# EAGLE board v.0.0.0 (EAGLE 5.11)
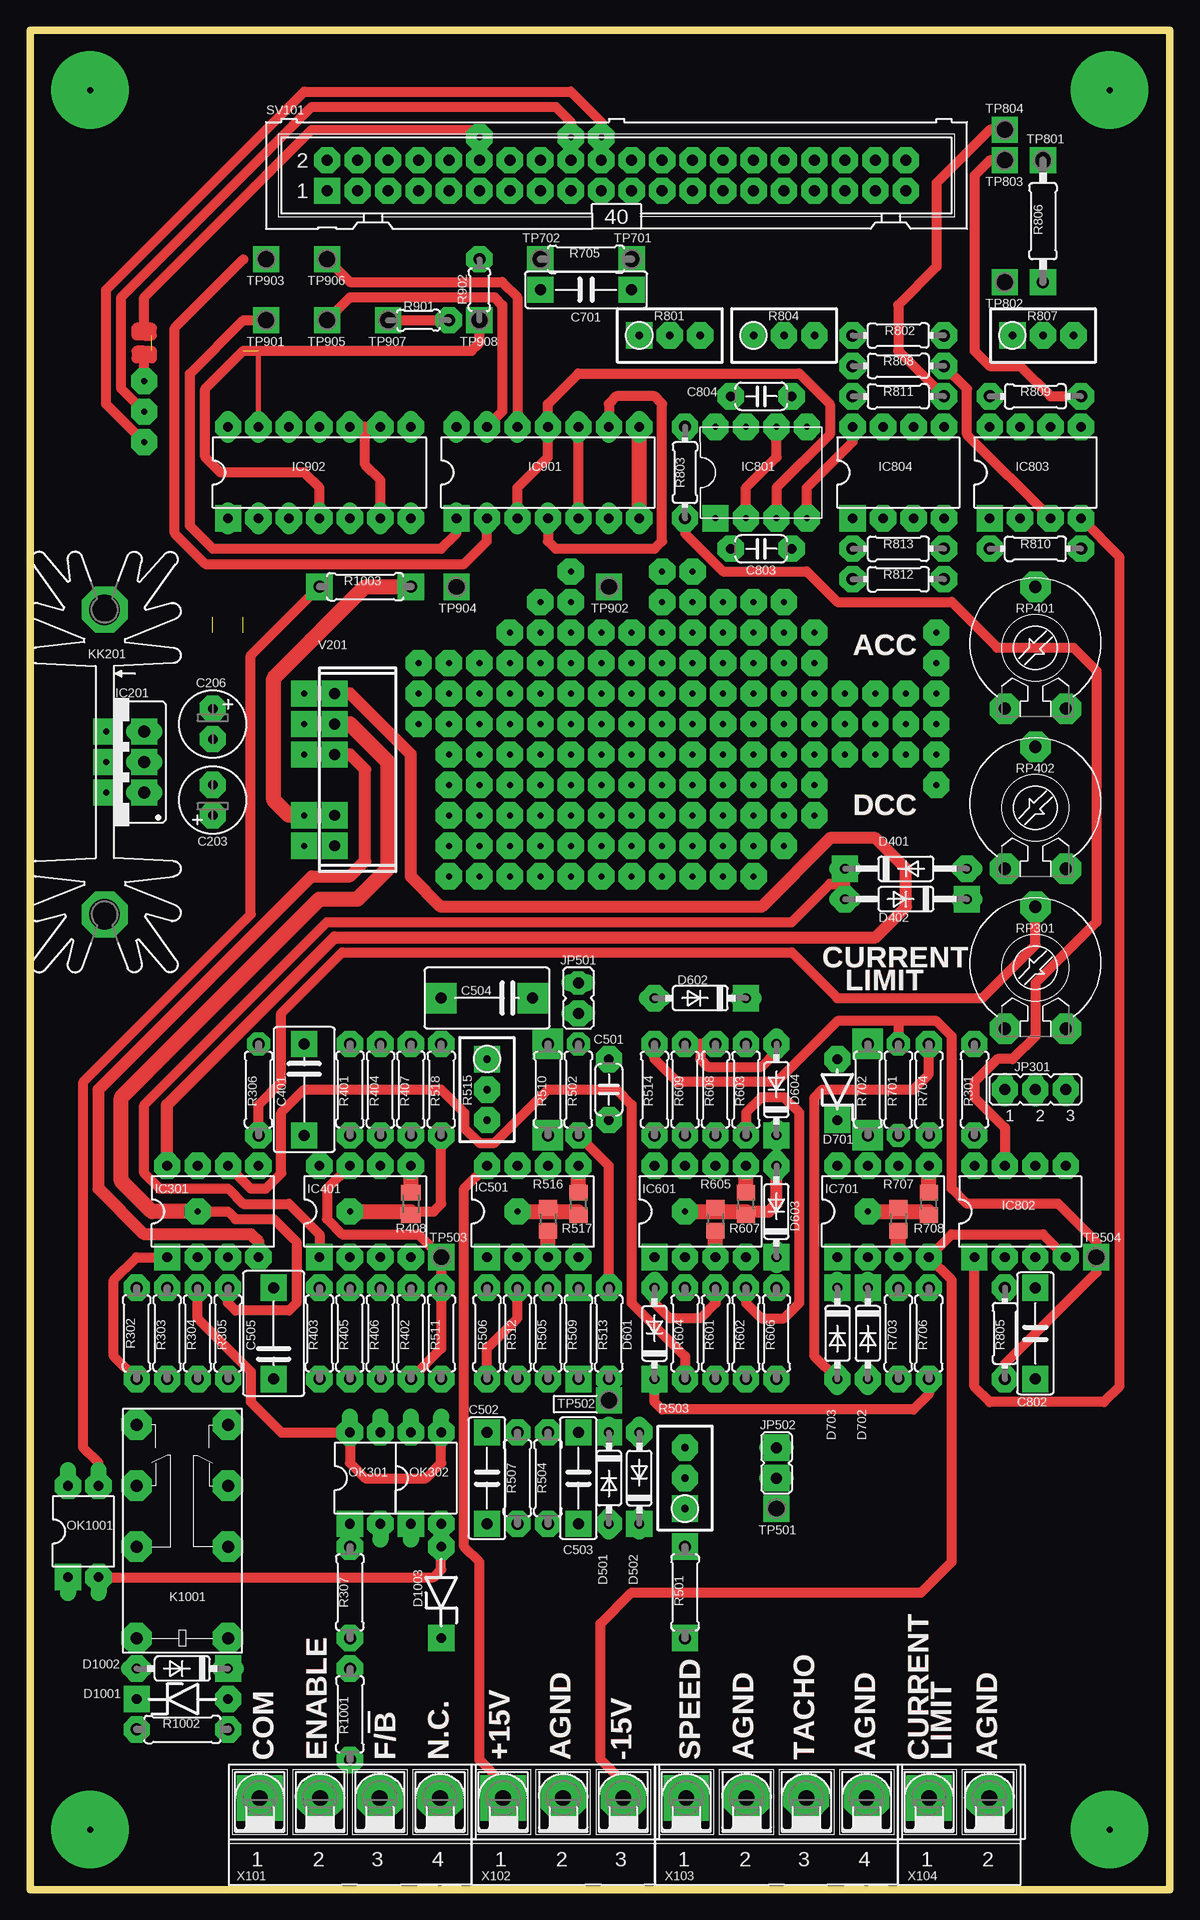
[diagram p10: board, top side]
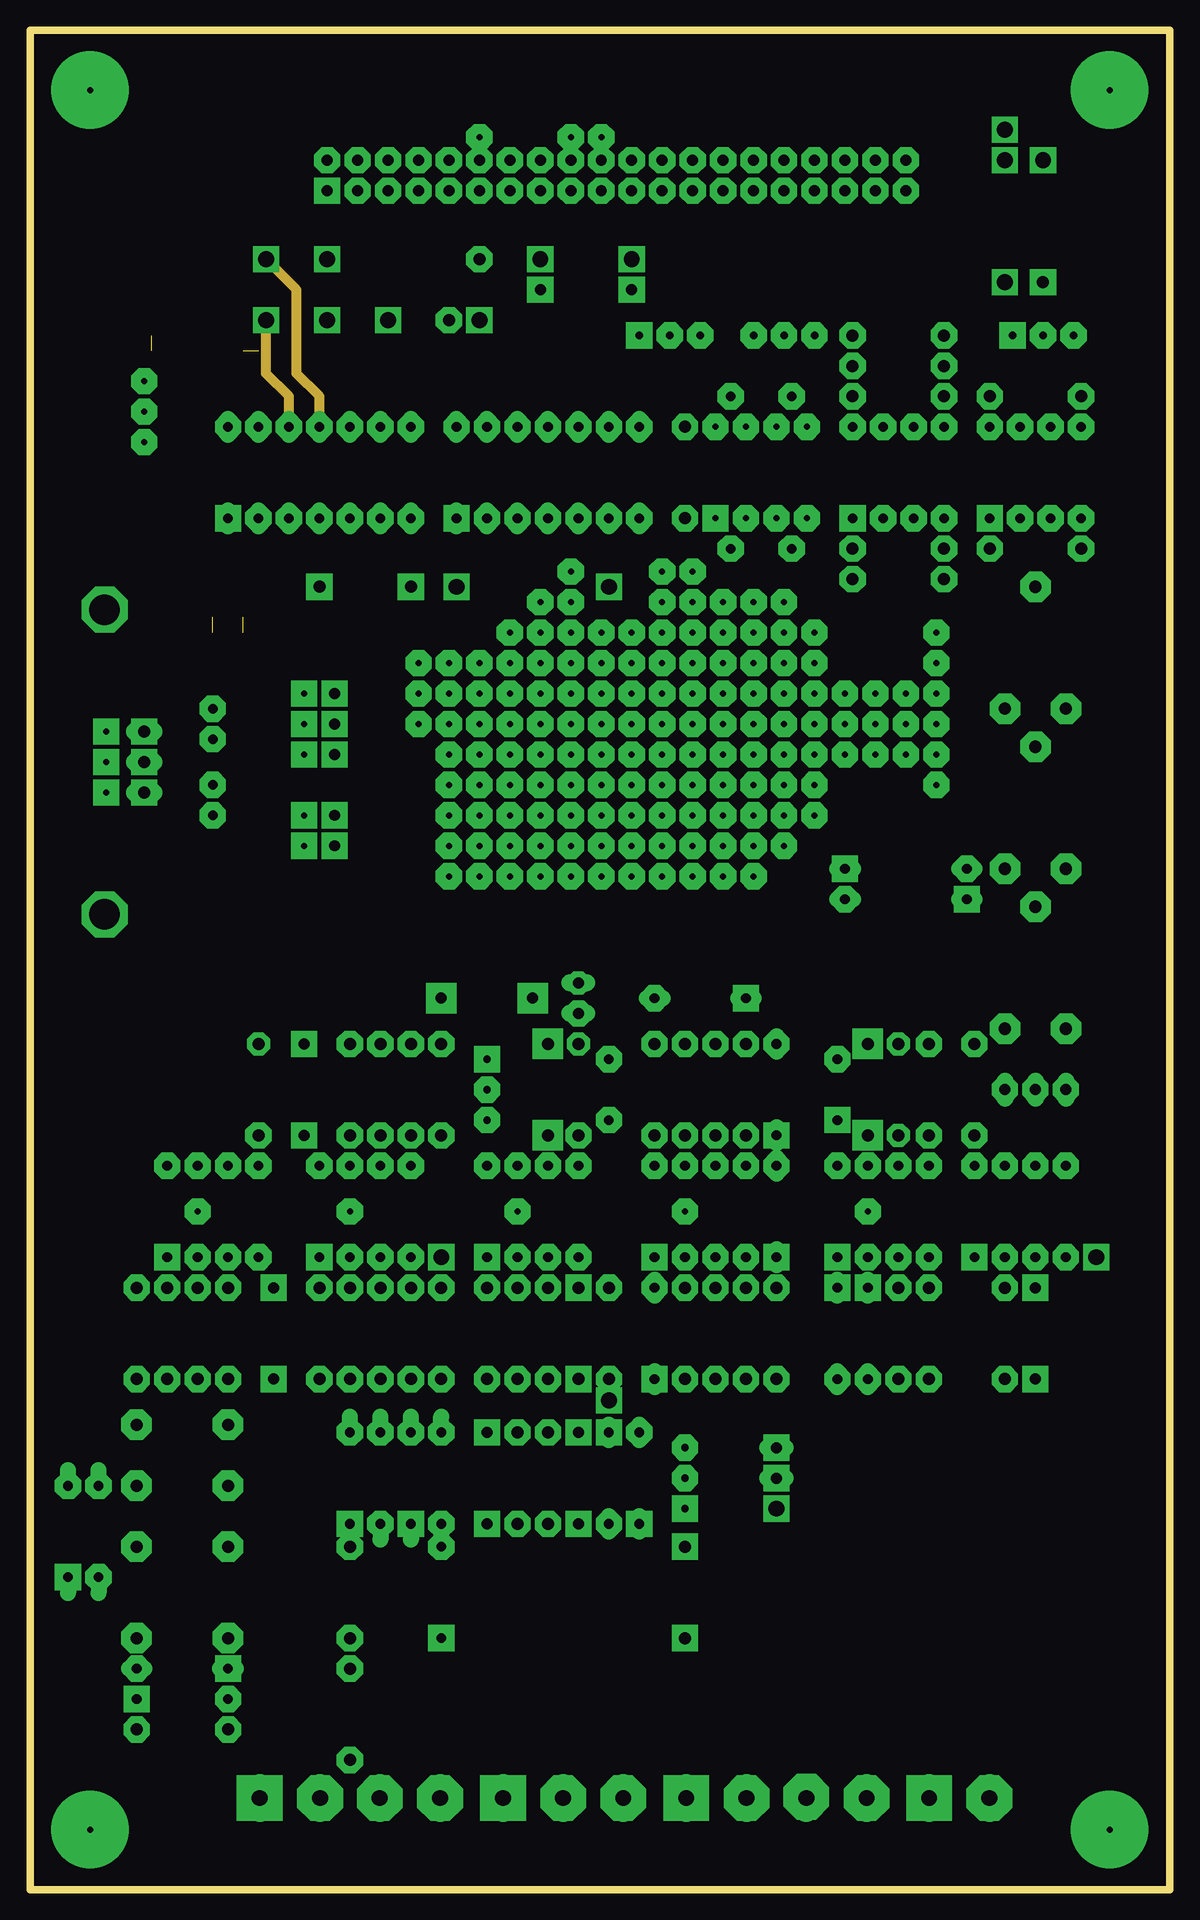
[diagram p11: board, inner layer Route2]
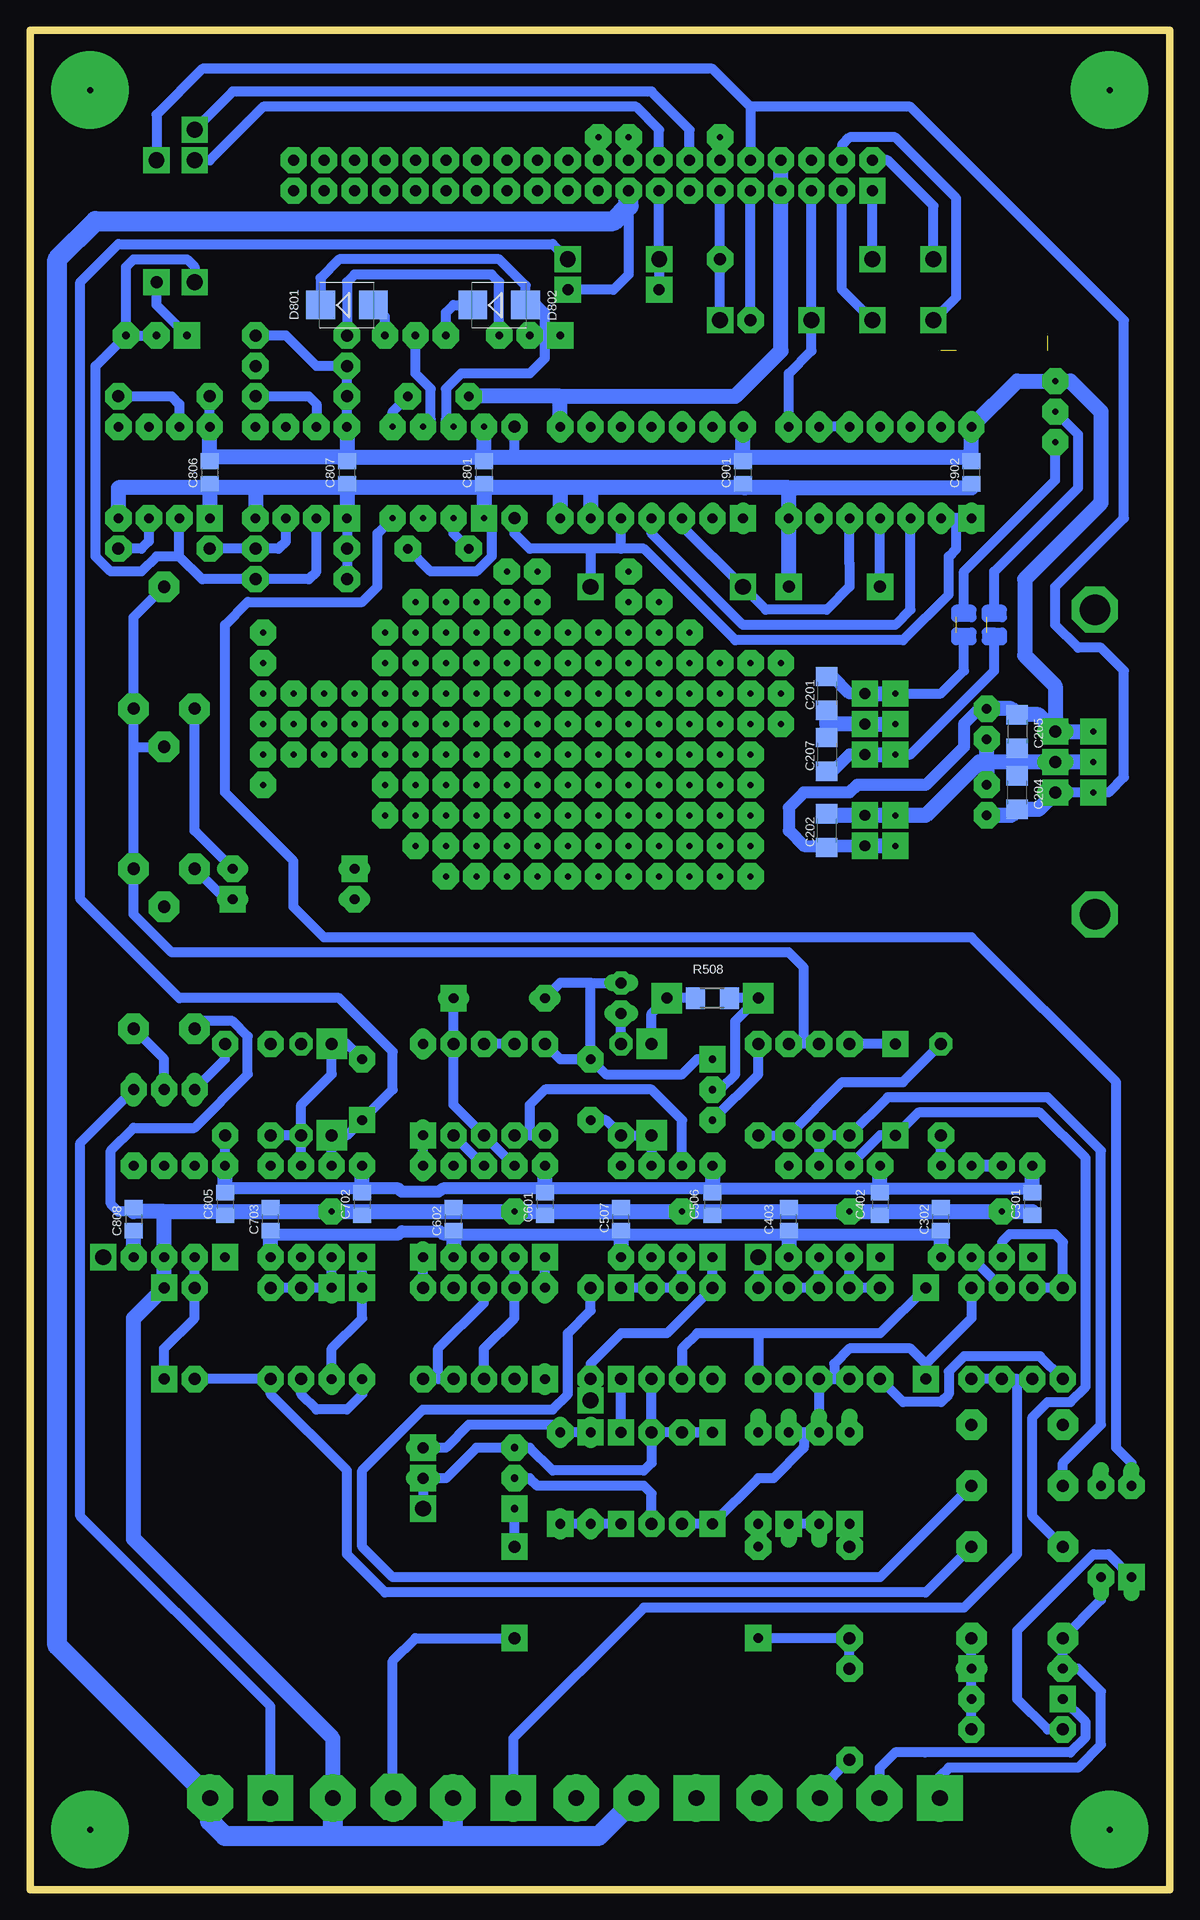
[diagram p12: board, bottom side, seen from below]

Size 95 x 155 mm. Coordinates in mm from the lower left corner, seen from the top.
Outline: 0,0 95,0 95,155 0,155 0,0
Copper layers (1*2*16): Top 0.035mm / dielectric 1.5mm / Route2 0.035mm / dielectric 0.15mm / Bottom 0.035mm
Design rules "default *": minimum track width 10mil, minimum drill 24mil, track to track 8mil, track to pad 8mil, pad to pad 8mil, via to via 8mil, smd to smd 8mil, copper to edge 40mil, drill to drill 8mil, minimum pad ring 10mil, minimum via ring 8mil, stop-mask expansion 4mil, vias tented up to drill 0mil, thermal gap 10mil

## Footprints (pad centres in the part's own frame; a part is rotated, then mirrored left to right if it is on the bottom)
C1206 = smd 1.6 x 1.8: 1 -1.4,0; 2 1.4,0
E2,5-6 = drill 0.813 pad 1.6 round: + -1.27,0 | drill 0.813 pad 1.6 octagon: - 1.27,0
C0805 = smd 1.3 x 1.5: 1 -0.95,0; 2 0.95,0
C075-052X106 = drill 0.914 octagon: 1 -3.81,0; 2 3.81,0
C050-024X044 = drill 0.813 octagon: 1 -2.54,0; 2 2.54,0
C075-032X103 = drill 0.914 octagon: 1 -3.81,0; 2 3.81,0
DO35-10 = drill 0.813 long: A 5.08,0; C -5.08,0
DO35-7 = drill 0.813 long: A 3.81,0; C -3.81,0
ZDIO-5 = drill 0.813 octagon: A 2.54,0; C -2.54,0
SMB = smd 2.4 x 2.4: A 2.2,0; C -2.2,0
ZDIO-7.5 = drill 0.813 octagon: A 3.81,0; C -3.81,0
78XXS = drill 1.016 long: GND 0,-2.54; IN -2.54,-2.54; OUT 2.54,-2.54
DIL08 = drill 0.813 pad 1.27 round: 1 -3.81,-3.81; 2 -1.27,-3.81; 3 1.27,-3.81; 4 3.81,-3.81; 5 3.81,3.81; 6 1.27,3.81; 7 -1.27,3.81; 8 -3.81,3.81
DIL8-HOME = drill 0.5 pad 2.184 square: 1 -3.81,-3.81 | drill 0.5 pad 2.184 octagon: 2 -1.27,-3.81; 3 1.27,-3.81; 4 3.81,-3.81; 5 3.81,3.81; 6 1.27,3.81; 7 -1.27,3.81; 8 -3.81,3.81
DIL14 = drill 0.813 long: 1 -7.62,-3.81; 2 -5.08,-3.81; 3 -2.54,-3.81; 4 0,-3.81; 5 2.54,-3.81; 6 5.08,-3.81; 7 7.62,-3.81; 8 7.62,3.81; 9 5.08,3.81; 10 2.54,3.81; 11 0,3.81; 12 -2.54,3.81; 13 -5.08,3.81; 14 -7.62,3.81
JP2 = drill 0.914 long: 1 -2.54,0; 2 0,0; 3 2.54,0
JP1 = drill 0.914 long: 1 0,-1.27; 2 0,1.27
G5V-2 = drill 1 pad 1.8 round: 1 -8.89,-3.81; 4 -1.27,-3.81; 6 3.81,-3.81; 8 8.89,-3.81; 9 8.89,3.81; 11 3.81,3.81; 13 -1.27,3.81; 16 -8.89,3.81
SK104-PAD = drill 2.54 pad 3.81 round: K1 -12.7,-0.762; K2 12.7,-0.762
DIL04 = drill 0.813 offset: 1 -1.27,-3.81; 2 1.27,-3.81; 3 1.27,3.81; 4 -1.27,3.81
0207/7 = drill 1 pad 1.676 octagon: 1 -3.81,0; 2 3.81,0
M0805 = smd 1.3 x 1.6: 1 -0.95,0; 2 0.95,0
RTRIM3296W = drill 0.61 round: 1 0,-2.54; 2 0,0; 3 0,2.54
R1206 = smd 1.6 x 1.803: 1 -1.422,0; 2 1.422,0
R0805 = smd 1.3 x 1.5: 1 -0.95,0; 2 0.95,0
0204/7 = drill 1 octagon: 1 -3.81,0; 2 3.81,0
0207/10 = drill 1 octagon: 1 -5.08,0; 2 5.08,0
0204/5 = drill 1 octagon: 1 -2.54,0; 2 2.54,0
PT-10 = drill 1.016 pad 1.778 octagon: 1 -2.54,-5.08; 2 2.54,-5.08; 3 0,5.08
ML40 = drill 0.914 octagon: 1 -24.13,-1.27; 2 -24.13,1.27; 3 -21.59,-1.27; 4 -21.59,1.27; 5 -19.05,-1.27; 6 -19.05,1.27; 7 -16.51,-1.27; 8 -16.51,1.27; 9 -13.97,-1.27; 10 -13.97,1.27; 11 -11.43,-1.27; 12 -11.43,1.27; 13 -8.89,-1.27; 14 -8.89,1.27; 15 -6.35,-1.27; 16 -6.35,1.27; 17 -3.81,-1.27; 18 -3.81,1.27; 19 -1.27,-1.27; 20 -1.27,1.27; 21 1.27,-1.27; 22 1.27,1.27; 23 3.81,-1.27; 24 3.81,1.27; 25 6.35,-1.27; 26 6.35,1.27; 27 8.89,-1.27; 28 8.89,1.27; 29 11.43,-1.27; 30 11.43,1.27; 31 13.97,-1.27; 32 13.97,1.27; 33 16.51,-1.27; 34 16.51,1.27; 35 19.05,-1.27; 36 19.05,1.27; 37 21.59,-1.27; 38 21.59,1.27; 39 24.13,-1.27; 40 24.13,1.27
P1-13 = drill 1.321 pad 2.159 octagon: TP 0,0
TMA_DUAL = drill 0.9 round: 1 -5.08,0; 2 -2.54,0; 5 2.54,0; 6 5.08,0; 7 7.62,0
AK500/4-H = drill 1.321 long: 1 -7.518,0; 2 -2.489,0; 3 2.489,0; 4 7.518,0
AK500/3-H = drill 1.321 long: 1 -5.004,0; 2 0,0; 3 5.004,0
AK500/2-H = drill 1.321 long: 1 -2.515,0; 2 2.515,0

## Placement (x,y rotation side)
C201  [C1206]  28.57,99.69 270 bottom
C202  [C1206]  28.57,88.27 90 bottom
C203  [E2,5-6]  15.24,90.81 90 top
C204  [C1206]  12.7,91.44 90 bottom
C205  [C1206]  12.7,96.52 270 bottom
C206  [E2,5-6]  15.24,97.16 270 top
C207  [C1206]  28.57,94.61 270 bottom
C301  100nF  [C0805]  11.43,57.15 270 bottom
C302  100nF  [C0805]  19.05,55.88 90 bottom
C401  1uF  [C075-052X106]  22.86,66.67 270 top
C402  100nF  [C0805]  24.13,57.15 270 bottom
C403  100nF  [C0805]  31.75,55.88 90 bottom
C501  3.3nF  [C050-024X044]  48.26,66.67 90 top
C502  220nF  [C075-032X103]  38.1,34.29 90 top
C503  10nF  [C075-032X103]  45.72,34.29 90 top
C504  50nF  [C075-052X106]  38.1,74.3 180 top
C505  1uF  [C075-052X106]  20.32,46.35 90 top
C506  100nF  [C0805]  38.1,57.15 270 bottom
C507  100nF  [C0805]  45.72,55.88 90 bottom
C601  100nF  [C0805]  52.07,57.15 270 bottom
C602  100nF  [C0805]  59.69,55.88 90 bottom
C701  220nF  [C075-032X103]  46.35,133.35 0 top
C702  100nF  [C0805]  67.31,57.15 270 bottom
C703  100nF  [C0805]  74.93,55.88 90 bottom
C801  100nF  [C0805]  57.15,118.11 270 bottom
C802  100nF  [C075-032X103]  83.82,46.35 90 top
C803  22nF  [C050-024X044]  60.96,111.76 0 top
C804  22nF  [C050-024X044]  60.96,124.46 180 top
C805  100nF  [C0805]  78.74,57.15 270 bottom
C806  100nF  [C0805]  80.01,118.11 270 bottom
C807  100nF  [C0805]  68.58,118.11 270 bottom
C808  100nF  [C0805]  86.36,55.88 270 bottom
C901  100nF  [C0805]  35.56,118.11 270 bottom
C902  100nF  [C0805]  16.51,118.11 270 bottom
D401  1N4148  [DO35-10]  73.03,85.09 0 top
D402  1N4148  [DO35-10]  73.03,82.55 180 top
D501  1N4148  [DO35-7]  48.26,34.29 270 top
D502  1N4148  [DO35-7]  50.8,34.29 90 top
D601  1N4148  [DO35-7]  52.07,46.35 90 top
D602  1N4148  [DO35-7]  55.88,74.3 180 top
D603  1N4148  [DO35-7]  62.23,56.52 90 top
D604  1N4148  [DO35-7]  62.23,66.67 90 top
D701  10V1  [ZDIO-5]  67.31,66.67 90 top
D702  1N4148  [DO35-7]  69.85,46.35 270 top
D703  1N4148  [DO35-7]  67.31,46.35 270 top
D801  SS14  [SMB]  68.58,132.08 0 bottom
D802  SS14  [SMB]  55.88,132.08 0 bottom
D1001  12V  [ZDIO-7.5]  12.7,15.88 0 top
D1002  1N4148  [DO35-7]  12.7,18.41 180 top
D1003  12V  [ZDIO-7.5]  34.29,24.77 90 top
IC201  [78XXS]  6.99,93.98 90 top
IC301  TL082P  [DIL08]  15.24,56.52 0 top
IC401  TL082P  [DIL08]  27.94,56.52 0 top
IC501  TL082P  [DIL08]  41.91,56.52 0 top
IC601  TL082P  [DIL08]  55.88,56.52 0 top
IC701  TL082P  [DIL08]  71.12,56.52 0 top
IC801  LM555  [DIL8-HOME]  60.96,118.11 0 top
IC802  LM311N  [DIL08]  82.55,56.52 0 top
IC803  LM311N  [DIL08]  83.82,118.11 0 top
IC804  LM311N  [DIL08]  72.39,118.11 0 top
IC901  4013N  [DIL14]  43.18,118.11 0 top
IC902  74HC00N  [DIL14]  24.13,118.11 0 top
JP301  [JP2]  83.82,66.67 0 top
JP501  [JP1]  45.72,74.3 0 top
JP502  [JP1]  62.23,35.56 0 top
K1001  G5V-2  [G5V-2]  12.7,29.84 90 top
KK201  SK104-PAD  [SK104-PAD]  6.99,93.98 270 top
OK301  PC817  [DIL04]  27.94,34.29 0 top
OK302  PC817  [DIL04]  33.02,34.29 0 top
OK1001  PC817  [DIL04]  4.45,29.84 0 top
R301  2.4K  [0207/7]  78.74,66.67 270 top
R302  51K  [0207/7]  8.89,46.35 270 top
R303  51K  [0207/7]  11.43,46.35 90 top
R304  51K  [0207/7]  13.97,46.35 90 top
R305  10K  [0207/7]  16.51,46.35 270 top
R306  51K  [0207/7]  19.05,66.67 270 top
R307  560  [0207/7]  26.67,24.77 90 top
R401  0R0  [0207/7]  26.67,66.67 90 top
R402  1.3K  [0207/7]  31.75,46.35 270 top
R403  1.3K  [0207/7]  24.13,46.35 90 top
R404  220K  [0207/7]  29.21,66.67 270 top
R405  10K  [0207/7]  26.67,46.35 90 top
R406  10K  [0207/7]  29.21,46.35 90 top
R407  1.3K  [0207/7]  31.75,66.67 90 top
R408  10K  [M0805]  31.75,57.15 90 top
R501  2.7K  [0207/7]  54.61,24.77 270 top
R502  20K  [0207/7]  45.72,66.67 90 top
R503  10K  [RTRIM3296W]  54.61,34.29 0 top
R504  3.9K  [0207/7]  43.18,34.29 90 top
R505  20K  [0207/7]  43.18,46.35 90 top
R506  20K  [0207/7]  38.1,46.35 90 top
R507  2.7K  [0207/7]  40.64,34.29 90 top
R508  5.1M  [R1206]  38.1,74.3 0 bottom
R509  10K  [0207/7]  45.72,46.35 90 top
R510  220K  [0207/7]  43.18,66.67 90 top
R511  10K  [0207/7]  34.29,46.35 270 top
R512  10K  [0207/7]  40.64,46.35 90 top
R513  20K  [0207/7]  48.26,46.35 90 top
R514  2.7K  [0207/7]  52.07,66.67 90 top
R515  10K  [RTRIM3296W]  38.1,66.67 180 top
R516  20K  [R0805]  43.18,55.88 270 top
R517  20K  [R0805]  45.72,57.15 90 top
R518  5.1K  [0207/7]  34.29,66.67 90 top
R601  10K  [0207/7]  57.15,46.35 90 top
R602  10K  [0207/7]  59.69,46.35 90 top
R603  10K  [0207/7]  59.69,66.67 90 top
R604  10K  [0207/7]  54.61,46.35 90 top
R605  10K  [R0805]  57.15,55.88 270 top
R606  10K  [0207/7]  62.23,46.35 270 top
R607  10K  [R0805]  59.69,57.15 90 top
R608  10K  [0207/7]  57.15,66.67 270 top
R609  NA  [0207/7]  54.61,66.67 270 top
R701  20K  [0207/7]  72.39,66.67 270 top
R702  20K  [0207/7]  69.85,66.67 270 top
R703  10K  [0207/7]  72.39,46.35 270 top
R704  10K  [0207/7]  74.93,66.67 270 top
R705  1.3K  [0207/7]  46.35,135.89 180 top
R706  10K  [0207/7]  74.93,46.35 90 top
R707  10K  [R0805]  72.39,55.88 270 top
R708  10K  [R0805]  74.93,57.15 90 top
R801  2K  [RTRIM3296W]  53.34,129.54 270 top
R802  510  [0204/7]  72.39,129.54 0 top
R803  5.1K  [0204/7]  54.61,118.11 90 top
R804  2K  [RTRIM3296W]  62.87,129.54 270 top
R805  1K  [0204/7]  81.28,46.35 270 top
R806  10K  [0207/10]  84.45,139.06 90 top
R807  10K  [RTRIM3296W]  84.45,129.54 270 top
R808  10K  [0204/7]  72.39,127 180 top
R809  5.1K  [0204/7]  83.82,124.46 180 top
R810  1.3K  [0204/7]  83.82,111.76 0 top
R811  5.1K  [0204/7]  72.39,124.46 180 top
R812  2.7K  [0204/7]  72.39,109.22 0 top
R813  10K  [0204/7]  72.39,111.76 0 top
R901  0R0  [0204/5]  32.38,130.81 0 top
R902  0R0  [0204/5]  37.47,133.35 90 top
R1001  470  [0207/7]  26.67,14.61 90 top
R1002  5.1K  [0207/7]  12.7,13.34 180 top
R1003  10K  [0207/7]  27.94,108.58 180 top
RP301  5.7K  [PT-10]  83.82,76.83 0 top
RP401  5.7K  [PT-10]  83.82,103.5 0 top
RP402  5.7K  [PT-10]  83.82,90.17 0 top
SV101  [ML40]  48.9,142.88 0 top
TP501  TPPAD1-13  [P1-13]  62.23,31.75 0 top
TP502  TPPAD1-13  [P1-13]  48.26,40.77 0 top
TP503  TPPAD1-13  [P1-13]  34.29,52.7 0 top
TP504  TPPAD1-13  [P1-13]  88.9,52.7 0 top
TP701  TPPAD1-13  [P1-13]  50.16,135.89 0 top
TP702  TPPAD1-13  [P1-13]  42.55,135.89 0 top
TP801  TPPAD1-13  [P1-13]  84.45,144.15 0 top
TP802  TPPAD1-13  [P1-13]  81.28,133.99 0 top
TP803  TPPAD1-13  [P1-13]  81.28,144.15 0 top
TP804  TPPAD1-13  [P1-13]  81.28,146.69 0 top
TP901  TPPAD1-13  [P1-13]  19.68,130.81 90 top
TP902  TPPAD1-13  [P1-13]  48.26,108.58 0 top
TP903  TPPAD1-13  [P1-13]  19.68,135.89 90 top
TP904  TPPAD1-13  [P1-13]  35.56,108.58 0 top
TP905  TPPAD1-13  [P1-13]  24.77,130.81 90 top
TP906  TPPAD1-13  [P1-13]  24.77,135.89 90 top
TP907  TPPAD1-13  [P1-13]  29.84,130.81 90 top
TP908  TPPAD1-13  [P1-13]  37.47,130.81 0 top
V201  AM1D-0515DZ  [TMA_DUAL]  25.4,92.08 90 top
X101  [AK500/4-H]  26.67,7.62 0 top
X102  [AK500/3-H]  44.45,7.62 0 top
X103  [AK500/4-H]  62.23,7.62 0 top
X104  [AK500/2-H]  77.47,7.62 0 top

## Tracks (layer width: path | path; a pad name or v marks a point on that pad's centre or on a via)
2.????V  (via drill 0.5 pad 2.18)
  Top 0.813: IC803.3 78.11,121.28 78.11,125.09 R808.1
  Bottom 0.813: R810.2 85.72,111.76 85.09,112.39 IC803.3
  other vias: 87.63,111.76 85.09,114.3 76.2,127
2.???V  (via drill 0.5 pad 2.18)
  Bottom 0.813: IC804.3 73.66,112.39 74.3,111.76 R813.2 R810.1
  other vias: 73.66,114.3 76.2,111.76 80.01,111.76
!MCU_EN_G1  (via drill 0.5 pad 2.18)
  Route2 0.813: IC902.11 24.13,124.46 22.23,126.36 22.23,133.35 TP903.TP
  Bottom 0.813: SV101.2 23.5,144.15 19.68,140.34 TP903.TP
  other vias: 24.77,144.15 19.68,135.89
!MCU_EN_G2  (via drill 0.5 pad 2.18)
  Top 0.813: IC901.12 40.64,132.72 39.37,133.99 26.67,133.99 TP906.TP
  Bottom 0.813: TP906.TP SV101.1
  other vias: 24.77,141.6 24.77,135.89 40.64,121.92
+5V  (via drill 0.5 pad 2.18)  (1 unrouted)
  Top 0.813: IC801.4 64.77,116.84 68.58,120.65 IC804.8 | v37.47,146.05 36.83,146.69 23.5,146.69 9.53,132.72 9.53,129.54 | v9.53,125.73 9.53,128.27 | 9.53,128.27 8.89,128.27 8.89,127.64 10.16,127.64 10.16,128.27 9.53,128.27 | 9.53,129.54 8.89,129.54 8.89,130.18 10.16,130.18 10.16,129.54 9.53,129.54
  Bottom 0.406: 16.51,119.38 C902.1 | 35.56,119.38 C901.1
  Bottom 0.813: 54.61,119.38 R803.2 | IC803.8 R809.2 | IC804.8 R811.2 R808.2 71.12,127 73.66,129.54 R802.2 | 57.15,119.38 C801.1 | v3.17,33.66 3.17,35.56 4.45,36.83 4.45,67.31 16.51,79.38 70.48,79.38 73.03,81.92 73.03,85.72 78.74,91.44 78.74,105.41 76.83,107.31 67.31,107.31 66.04,108.58 66.04,113.03 IC801.4 | v37.47,146.05 SV101.12 | 68.58,119.38 C807.1 | 80.01,119.38 C806.1
  Bottom 1.016: V201.1 28.45,87 | v22.86,87 30.48,87 31.75,88.27 31.75,90.17 30.48,91.44 26.67,91.44 26.04,92.08 20.32,92.08 17.14,95.25 17.14,97.16 15.88,98.42 C206.+
  Bottom 1.27: 35.56,119.38 16.51,119.38 IC902.14 12.7,125.73 v9.53,125.73 8.26,125.73 5.71,123.19 5.71,115.57 12.06,109.22 12.06,102.87 9.53,100.33 IC201.OUT | 35.56,119.38 54.61,119.38 57.15,119.38 | 57.15,119.38 IC801.8 | IC804.8 68.58,119.38 | 68.58,119.38 80.01,119.38 IC803.8 | 68.58,119.38 57.15,119.38 | 35.56,119.38 IC901.14 | C206.+ 13.21,98.42 C205.1 10.93,97.92 IC201.OUT | IC201.OUT v6.35,96.52 | 28.45,87 C202.1 | v22.86,87 V201.1
  other vias: 35.56,121.92 16.51,121.92 68.58,127 68.58,124.46 68.58,121.92 80.01,121.92 80.01,124.46 54.61,121.92 76.2,129.54 15.24,98.42 9.53,96.52 37.47,144.15 25.4,87
+15V  (via drill 0.5 pad 2.18, 0.5 pad 3.81)  (1 unrouted)
  Top 0.813: X102.1 39.45,8.81 37.47,10.79 37.47,27.3 36.2,28.57 36.2,58.42 IC501.8 | v47.62,146.05 47.62,147.32 45.09,149.86 22.86,149.86 6.35,133.35 6.35,123.83 v9.53,120.65
  Top 1.016: IC301.8 11.43,65.41 25.4,79.38 70.48,79.38 73.03,81.92 73.03,85.09 70.48,87.63 66.67,87.63 60.96,81.92 34.29,81.92 31.75,84.45 31.75,94.61 26.67,99.69 v25.4,99.69
  Top 1.27: v25.4,99.69 v22.86,99.69
  Bottom 0.813: IC802.8 v78.74,62.87 | v9.53,120.65 9.53,117.47 17.14,109.86 17.14,106.68 | 17.14,106.68 16.51,106.68 16.51,106.05 17.78,106.05 17.78,106.68 17.14,106.68 | 17.14,104.14 16.51,104.14 16.51,104.78 17.78,104.78 17.78,104.14 17.14,104.14 | v22.86,99.69 19.05,99.69 17.14,101.6 17.14,104.14 | SV101.20 v47.62,146.05
  Bottom 1.016: 23.82,58.42 11.43,58.42 | 23.82,58.42 C402.1 | 38.1,58.42 23.82,58.42 | 38.1,58.42 C506.1 | 38.1,58.42 52.07,58.42 60.58,58.42 60.96,58.17 64.01,58.17 64.26,58.42 67.31,58.42 78.74,58.42 | C201.1 28.07,101.09 26.67,99.69 v25.4,99.69
  Bottom 1.27: IC501.8 38.1,58.42 | C402.1 IC401.8 | C702.1 67.31,58.42 IC701.8 | C601.1 52.07,58.42 IC601.8 | C805.1 78.74,58.42 IC802.8 | 11.43,58.42 C301.1 IC301.8 | v25.4,99.69 v22.86,99.69
  other vias: 24.13,60.33 38.1,60.33 67.31,60.33 52.07,60.33 78.74,60.33 11.43,60.33 39.45,7.62 47.62,144.15
-15V  (via drill 0.5 pad 2.18, 0.5 pad 3.81)  (1 unrouted)
  Top 0.813: IC802.4 84.45,54.61 76.83,54.61 IC701.4 76.83,50.8 76.83,27.3 74.3,24.77 50.16,24.77 47.55,22.15 47.55,10.87 49.53,8.89 X102.3 | v45.09,146.05 45.09,147.32 43.81,148.59 23.5,148.59 7.62,132.72 7.62,125.09 v9.53,123.19
  Top 1.016: IC301.4 19.05,53.98 18.41,54.61 9.53,54.61 5.71,58.42 5.71,66.67 23.5,84.45 26.67,84.45 27.94,85.72 27.94,93.34 26.67,94.61 v25.4,94.61
  Top 1.27: v25.4,94.61 v22.86,94.61
  Bottom 0.813: IC701.4 C703.1 | v9.53,123.19 7.62,121.28 7.62,116.84 14.61,109.86 14.61,106.68 | v45.09,146.05 SV101.18 | 14.61,106.68 13.97,106.68 13.97,106.05 15.24,106.05 15.24,106.68 14.61,106.68 | v22.86,94.61 21.59,94.61 14.61,101.6 14.61,104.78 | 14.61,104.78 13.97,104.78 13.97,104.14 15.24,104.14 15.24,104.78 14.61,104.78
  Bottom 1.016: 59.69,54.61 45.72,54.61 | 59.69,54.61 60.58,54.61 60.83,54.86 64.01,54.86 64.26,54.61 74.93,54.61 C703.1 | 31.75,54.61 19.05,54.61 | 45.72,54.61 31.75,54.61 | 31.75,54.61 C403.1 | 59.69,54.61 C602.1 | 45.72,54.61 C507.1 | C207.2 28.07,93.22 26.67,94.61 v25.4,94.61
  Bottom 1.27: 45.72,54.61 IC501.4 | 31.75,54.61 IC401.4 | IC701.4 74.93,54.61 | 59.69,54.61 IC601.4 | IC802.4 C808.2 | C302.1 19.05,54.61 IC301.4 | v25.4,94.61 v22.86,94.61
  other vias: 31.75,52.7 45.72,52.7 74.93,52.7 59.69,52.7 86.36,52.7 19.05,52.7 49.45,7.62 45.09,144.15
AGND  (via drill 0.5 pad 1.93, 0.5 pad 2.18, 0.5 pad 2.54, 0.5 pad 3.81)
  Top 0.813: R305.1 16.51,48.9 17.14,48.26 21.59,48.26 22.23,48.9 22.23,53.98 20.32,55.88 17.14,55.88 16.51,56.52 v13.97,56.52 | v34.29,62.87 34.29,57.15 33.66,56.52 v26.67,56.52
  Top 1.016: D603.A 62.23,57.15 61.59,56.52 59.69,56.52
  Top 1.27: v40.64,56.52 43.18,56.52 | 43.18,56.52 45.72,56.52 R517.1 | v13.97,56.52 10.16,56.52 7.62,59.05 7.62,66.04 24.13,82.55 27.3,82.55 29.84,85.09 29.84,93.98 26.67,97.16 V201.6 v22.86,97.16 | v54.61,56.52 57.15,56.52 | 57.15,56.52 59.69,56.52 R607.1 | 57.15,56.52 R605.1 | 43.18,56.52 R516.1 | v26.67,56.52 31.75,56.52 R408.1 | v69.85,56.52 72.39,56.52 | 72.39,56.52 74.93,56.52 R708.1 | 72.39,56.52 R707.1
  Bottom 0.813: 31.75,56.52 C403.2 | 24.13,56.52 C402.2 | 38.1,56.52 C506.2 | 45.72,56.52 C507.2 | 67.31,56.52 C702.2 | 27.94,42.55 v26.67,42.55 | 20.32,43.81 21.59,45.09 26.67,45.09 27.94,43.81 27.94,42.55 | R306.1 22.23,67.31 27.3,67.31 v31.75,62.87 v34.29,62.87 | R305.1 16.51,47.62 20.32,43.81 | 20.32,43.81 v20.32,42.55 | 27.94,42.55 v29.21,42.55 OK301.3 30.48,38.1 | 30.48,38.1 OK302.4 | 30.48,38.1 30.48,36.94 arc45 30.55,36.76 33.02,34.29 34.29,34.29 C502.1 R507.1 | RP301.1 80.64,72.39 78.11,72.39 76.83,71.12 76.83,67.94 81.28,63.5 86.36,63.5 88.27,61.59 88.27,57.15 87.63,56.52 86.67,56.52 C808.1 | D603.A v62.23,62.87 | C701.2 46.35,133.35 45.09,134.62 SV101.17
  Bottom 1.016: 59.69,56.52 C602.2 | 52.07,56.52 C601.2 | 78.74,56.52 C805.2 | 86.36,56.52 C808.1 | 19.05,56.52 C302.2 | 11.43,56.52 C301.2 | 74.93,56.52 C703.2
  Bottom 1.27: 83.82,56.52 78.74,56.52 74.93,56.52 v69.85,56.52 67.31,56.52 59.69,56.52 v54.61,56.52 52.07,56.52 45.72,56.52 v40.64,56.52 38.1,56.52 31.75,56.52 v26.67,56.52 24.13,56.52 19.05,56.52 v13.97,56.52 11.43,56.52 | 83.82,56.52 86.36,56.52 | 83.82,56.52 IC802.3 C802.2 86.36,47.62 86.36,29.21 69.75,12.6 X103.4 | 70.48,4.45 69.75,5.18 | 28.57,97.16 V201.6 v22.86,97.16 | 28.57,97.16 C207.1 | 28.57,97.16 C201.2
  Bottom 1.676: X102.2 47.62,4.45 60.33,4.45 | SV101.17 45.09,140.34 46.35,139.06 89.53,139.06 92.71,135.89 92.71,20.34 X104.2 79.98,5.69 78.74,4.45 70.48,4.45 60.33,4.45 | 69.75,5.18 X103.4 | X103.2 59.74,5.03 60.33,4.45
  other vias: 83.82,52.7 81.28,71.75 29.21,38.1 31.75,38.1 16.51,50.16 19.05,70.48 44.45,7.62 38.1,30.48 40.64,30.48 69.75,7.62 59.74,7.62 79.98,7.62 45.09,141.6 25.4,97.16 83.82,50.16 62.23,60.33 50.16,133.35
BR  (via drill 0.5 pad 2.18)
  Top 0.813: TP803.TP 80.01,144.15 78.74,142.88 78.74,128.27 80.01,127 82.55,127 85.09,124.46 R809.1
  Bottom 0.813: R809.1 83.19,124.46 82.55,123.83 IC803.7 | SV101.16 42.55,146.69 44.45,148.59 75.56,148.59 80.01,144.15 TP803.TP
  other vias: 82.55,121.92 87.63,124.46 81.28,144.15 42.55,144.15
CHARGE_RELAY  (via drill 0.5 pad 2.18)
  Top 0.813: TP804.TP 80.01,146.69 75.56,142.24 75.56,135.25 72.39,132.08 72.39,128.27 R811.1
  Bottom 0.813: R811.1 71.75,124.46 71.12,123.83 IC804.7 | SV101.14 40.01,146.69 43.18,149.86 78.11,149.86 TP804.TP
  other vias: 71.12,121.92 76.2,124.46 81.28,146.69 40.01,144.15
COM  (via drill 0.5 pad 2.18, 0.5 pad 2.54, 0.5 pad 3.81)
  Top 0.813: D1003.A 34.29,26.67 33.66,26.04 OK1001.2
  Bottom 0.813: OK1001.2 5.71,24.13 K1001.16 D1002.A 7.62,18.41 5.71,16.51 5.71,12.06 7.62,10.16 18.41,10.16 19.15,9.42 X101.1 | D1003.A OK302.2
  other vias: 34.29,30.48 8.89,18.41 8.89,20.95 5.71,26.04 19.15,7.62 34.29,28.57
CURRENT_LIMIT  (via drill 0.5 pad 2.18)
  Top 0.813: IC301.6 18.41,58.42 19.68,58.42 20.95,59.69 20.95,64.77 22.86,66.67 34.29,66.67 36.2,64.77 36.2,63.5 37.47,62.23 38.73,62.23 43.18,66.67 48.9,66.67 50.16,65.41 50.16,48.9 54.61,44.45 v54.61,42.55
  Bottom 1.016: IC301.7 IC301.6
  other vias: 13.97,60.33 16.51,60.33
CURRENT_LIMIT_IN  (via drill 0.5 pad 2.18)
  Bottom 0.813: IC501.7 40.64,64.14 43.18,66.67 52.07,66.67 53.34,65.41 53.34,62.87 | 53.34,62.87 v54.61,62.87 | 53.34,62.87 v52.07,62.87
  other vias: 40.64,60.33
DC++  (via drill 0.5 pad 2.18)
  Bottom 0.813: IC201.IN v6.35,91.44 5.08,91.44 3.81,92.71 3.81,101.6 5.71,103.5 7.62,103.5 9.53,105.41 9.53,108.58 3.81,114.3 3.81,130.81 21.59,148.59 34.92,148.59 | 34.92,148.59 38.1,151.76 80.64,151.76 84.45,147.96 TP801.TP | 34.92,148.59 v34.92,144.15
  Bottom 1.27: v15.24,89.53 13.21,89.53 C204.1 10.93,90.04 IC201.IN
  other vias: 84.45,144.15 9.53,91.44 84.45,144.15
DI_F/!B  (via drill 0.5 pad 2.18, 0.5 pad 3.81)
  Bottom 0.813: R1001.1 29.16,8.31 X101.3
  other vias: 29.16,7.62 26.67,10.79
DIRECTION  (via drill 0.5 pad 2.18)
  Top 0.813: IC901.5 IC901.10 | R803.1 54.61,113.03 57.78,109.86 64.77,109.86 67.31,107.31 76.83,107.31 80.64,103.5 87,103.5 88.9,101.6 88.9,80.64 83.82,75.56 83.82,71.12 81.92,69.22 80.64,69.22 78.74,67.31 78.74,66.04 81.28,63.5 IC802.7
  Bottom 0.813: IC902.1 IC902.2 | 45.72,111.76 IC901.5 | 45.72,111.76 43.81,111.76 36.2,104.14 22.23,104.14 18.41,107.95 18.41,111.12 17.78,111.76 17.78,114.3 | 45.72,111.76 48.26,111.76 | 48.26,111.76 53.34,111.76 54.61,113.03 R803.1 | 48.26,111.76 TP902.TP
  other vias: 54.61,114.3 45.72,114.3 45.72,121.92 16.51,114.3 19.05,114.3 81.28,60.33 48.26,108.58
EN_OR_PWM  (via drill 0.5 pad 2.18)
  Bottom 0.813: IC902.8 31.75,126.36 29.84,128.27 TP907.TP v29.84,141.6
  other vias: 31.75,121.92 29.84,130.81 29.84,130.81
ENABLE  (via drill 0.5 pad 2.18, 0.5 pad 3.81)
  Bottom 0.813: D1001.C 6.99,13.97 6.99,12.7 8.26,11.43 20.37,11.43 22.86,11.43 24.18,10.11 X101.2
  other vias: 8.89,15.88 24.18,7.62
ERROR_OUT  (via drill 0.5 pad 2.18)
  Bottom 0.813: IC501.1 R506.2 41.91,46.35 45.72,46.35 48.26,43.81 v48.26,42.55 TP502.TP
  other vias: 38.1,52.7 38.1,50.16 48.26,40.77
EXT_CURRENT_LIMIT  (via drill 0.5 pad 2.18, 0.5 pad 3.81)
  Bottom 0.813: JP301.3 90.81,62.23 90.81,31.11 74.95,15.27 X104.1
  other vias: 86.36,66.67 74.96,7.62
F/!B  (via drill 0.5 pad 2.18)
  Bottom 0.813: v34.29,20.95 v26.67,20.95 R1001.2
  other vias: 26.67,18.41
FB_TACHO  (via drill 0.5 pad 2.18, 0.5 pad 3.81)
  Bottom 0.813: v54.61,20.95 62.87,20.95 64.77,19.05 64.77,7.77 v64.72,7.72 X103.3
GND  (via drill 0.5 pad 2.18)
  Top 0.813: IC802.1 78.74,41.91 80.01,40.64 89.53,40.64 90.81,41.91 90.81,111.12 IC803.4
  Top 1.27: IC901.7 IC901.8 | R1003.1 27.94,108.58 20.32,100.97 20.32,90.81 21.59,89.53 v22.86,89.53 V201.2
  Bottom 0.406: C901.2 35.43,117.16 35.43,116.84 | 16.51,116.84 C902.2
  Bottom 0.813: R812.1 R813.1 IC804.1 | 57.15,116.84 C801.2 | C803.2 61.59,109.86 57.78,109.86 56.52,111.12 56.52,113.67 IC801.1 | 68.58,116.84 C807.2 | 80.01,116.84 C806.2
  Bottom 1.27: v32.38,144.15 v32.38,141.6 32.38,128.27 36.2,124.46 50.8,124.46 | 31.75,116.84 IC902.7 R1003.1 | 31.75,116.84 16.51,116.84 | 31.75,116.84 35.43,116.84 48.26,116.84 | 48.26,116.84 50.8,116.84 | 50.8,116.84 57.15,116.84 | 57.15,116.84 IC801.1 | IC803.4 87.63,116.84 80.01,116.84 | 57.15,116.84 68.58,116.84 | 68.58,116.84 76.2,116.84 | 76.2,116.84 80.01,116.84 | 68.58,116.84 IC804.1 | 76.2,116.84 IC804.4 | 80.01,116.84 IC803.1 | IC901.8 50.8,124.46 | 50.8,116.84 IC901.7 | 48.26,116.84 IC901.6 | 50.8,124.46 C804.2 | 15.24,93.98 C203.- | 12.7,93.98 C204.2 | IC201.GND v6.35,93.98 12.7,93.98 | 12.7,93.98 C205.2 | 12.7,93.98 15.24,93.98 | 15.24,93.98 C206.- | C202.2 28.45,89.53 V201.2 v22.86,89.53 20.32,89.53 15.88,93.98 15.24,93.98
  other vias: 31.75,114.3 50.8,114.3 68.58,114.3 76.2,114.3 68.58,111.76 68.58,109.22 80.01,114.3 87.63,114.3 63.5,111.76 58.42,124.46 48.26,114.3 50.8,121.92 78.74,52.7 31.75,108.58 31.75,114.3 15.24,95.89 15.24,92.08 9.53,93.98 25.4,89.53
MCU_EN_G3  (via drill 0.5 pad 2.18)
  Top 0.813: IC901.13 39.37,123.19 39.37,132.08 38.73,132.72 26.67,132.72 TP905.TP
  Bottom 0.813: TP905.TP 27.3,133.35 v27.3,141.6
  other vias: 24.77,130.81 38.1,121.92
MCU_EN_G4  (via drill 0.5 pad 2.18)
  Top 0.813: TP901.TP 17.78,130.81 13.34,126.36 13.34,113.67 15.24,111.76 34.29,111.76 35.56,113.03 IC901.1
  Route2 0.813: IC902.12 21.59,124.46 19.68,126.36 TP901.TP
  Bottom 0.813: TP901.TP 17.78,132.72 17.78,140.97 22.86,146.05 26.67,146.05 27.3,145.41 v27.3,144.15
  other vias: 19.68,130.81 35.56,114.3
N$1  (via drill 0.5 pad 2.18)
  other vias: 34.92,99.69
N$2  (via drill 0.5 pad 6.45)
  other vias: 5,5
N$3  (via drill 0.5 pad 6.45)
  other vias: 90,5
N$4  (via drill 0.5 pad 6.45)
  other vias: 5,150
N$5  (via drill 0.5 pad 6.45)
  other vias: 90,150
N$6  (via drill 0.5 pad 2.18, 0.5 pad 2.54)
  Bottom 0.813: 86.36,95.25 RP402.2 86.36,81.28 83.19,78.11 31.75,78.11 30.48,76.83 30.48,70.48 | 86.36,95.25 RP401.2 86.36,106.05 RP401.3 | R404.1 30.48,70.48 | 30.48,70.48 R407.2 | 86.36,95.25 RP402.3
  other vias: 29.21,70.48 31.75,70.48 86.36,85.09 86.36,98.42 83.82,95.25 83.82,108.58
N$7  (via drill 0.5 pad 2.18, 0.5 pad 2.54)
  Bottom 0.813: D402.C 78.74,82.55 RP402.1
  other vias: 81.28,85.09 78.11,82.55
N$8  (via drill 0.5 pad 2.18, 0.5 pad 2.54)
  Bottom 0.813: RP401.1 81.28,88.27 D401.A
  other vias: 81.28,98.42 78.11,85.09
N$9  (via drill 0.5 pad 2.18)
  Top 0.813: IC401.1 24.13,54.61 21.59,57.15 17.78,57.15 16.51,58.42 10.79,58.42 9.53,59.69 9.53,65.41 24.77,80.64 63.5,80.64 66.67,83.82 67.94,83.82 | 67.94,83.82 v67.94,82.55 | 67.94,83.82 v67.94,85.09
  other vias: 24.13,52.7
N$10  (via drill 0.5 pad 2.18, 0.5 pad 2.54)
  Bottom 0.813: JP301.2 83.82,69.22 RP301.2
  other vias: 83.82,66.67 86.36,71.75
N$11  (via drill 0.5 pad 2.18)
  Bottom 0.813: IC401.3 R406.2 R402.1
  other vias: 29.21,52.7 29.21,50.16 31.75,50.16
N$12  (via drill 0.5 pad 2.18)
  Bottom 0.813: R403.2 R405.2 IC401.2
  other vias: 26.67,52.7 24.13,50.16 26.67,50.16
N$13  (via drill 0.5 pad 2.18)
  Top 0.813: R512.2 40.64,47.62 38.1,45.09 v38.1,42.55
  Bottom 0.813: R509.2 R505.2 R512.2 IC501.2
  other vias: 40.64,52.7 45.72,50.16 43.18,50.16 40.64,50.16
N$14  (via drill 0.5 pad 2.18)
  Bottom 0.813: R401.2 24.13,70.48 C401.1
  other vias: 22.86,70.48 26.67,70.48
N$15  (via drill 0.5 pad 2.18)
  Bottom 0.813: C505.2 24.13,46.35 34.29,46.35 | 34.29,46.35 v34.29,42.55 | 34.29,46.35 39.37,46.35 40.64,45.09 v40.64,42.55
  other vias: 20.32,50.16
N$16  (via drill 0.5 pad 2.18)
  Top 0.813: IC901.4 43.18,112.39 43.81,111.76 52.07,111.76 52.7,112.39 52.7,123.83 52.07,124.46 48.9,124.46 48.26,123.83 IC901.9
  Bottom 0.813: IC902.3 21.59,106.68 22.86,105.41 35.56,105.41 43.18,113.03 IC901.4
  other vias: 21.59,114.3 43.18,114.3 48.26,121.92 43.18,114.3
N$17  (via drill 0.5 pad 2.18)
  Bottom 0.813: R501.1 R503.1
  other vias: 54.61,31.75 54.61,28.57
N$18  (via drill 0.5 pad 2.18)
  Top 0.813: 17.78,135.89 12.06,130.18 12.06,113.03 14.61,110.49 36.2,110.49 38.1,112.39 IC901.2
  other vias: 38.1,114.3 38.1,114.3
N$19  (via drill 0.5 pad 2.54)
  Bottom 0.813: R508.1 C504.1 43.18,73.03 R510.2
  other vias: 43.18,70.48 41.91,74.3
N$20  (via drill 0.5 pad 2.18, 0.6 pad 2.18)
  Bottom 0.813: R504.2 R507.2 39.37,38.1 C502.2 | R504.2 v43.18,42.55 | R504.2 43.18,35.56 43.81,34.92 51.44,34.92 53.34,36.83 R503.3 57.78,36.83 60.33,34.29 JP502.1 TP501.TP
  other vias: 62.23,34.29 38.1,38.1 54.61,36.83 43.18,38.1 40.64,38.1 62.23,31.75
N$21  (via drill 0.5 pad 1.93, 0.5 pad 2.18)
  Bottom 0.813: R502.2 JP501.1
  other vias: 45.72,70.48 45.72,73.03
N$22  (via drill 0.5 pad 2.18)
  Bottom 0.813: v38.1,64.14 34.29,67.94 R518.2
  other vias: 34.29,70.48
N$23  (via drill 0.5 pad 2.18, 0.6 pad 2.18)
  Bottom 0.813: C503.2 v45.72,42.55
  other vias: 45.72,38.1 45.72,38.1
N$24  (via drill 0.5 pad 2.18)
  Bottom 0.813: JP301.1 78.74,69.22 R301.1
  other vias: 81.28,66.67 78.74,70.48
N$25  (via drill 0.5 pad 2.18, 0.6 pad 2.18)
  Bottom 0.813: D502.C D501.A 46.99,30.48 C503.1
  other vias: 45.72,30.48 48.26,30.48 50.8,30.48
N$26  (via drill 0.5 pad 2.18)
  Bottom 0.813: R303.2 R302.1 8.89,53.98 9.53,54.61 13.34,54.61 13.97,53.98 IC301.2
  other vias: 11.43,50.16 13.97,52.7 8.89,50.16
N$27  (via drill 0.5 pad 2.18)
  Top 0.813: OK302.3 34.29,35.56 33.02,34.29 27.94,34.29 26.67,35.56 OK301.4 20.95,38.1 18.41,40.64 18.41,43.18 13.97,47.62 R304.2
  Bottom 0.813: R304.2 IC301.3
  other vias: 16.51,52.7 13.97,50.16 26.67,38.1 34.29,38.1
N$28  (via drill 0.5 pad 2.18, 0.6 pad 2.18)
  Bottom 0.813: D501.C D502.A 51.44,38.73 58.42,38.73 60.33,36.83 JP502.2
  other vias: 48.26,38.1 50.8,38.1 62.23,36.83
N$29  (via drill 0.5 pad 2.18)
  Top 0.813: IC902.6 29.21,117.47 27.94,118.75 27.94,121.92 | 27.94,121.92 IC902.10 | 27.94,121.92 IC902.9
  Bottom 0.813: IC902.10 IC902.9
  other vias: 26.67,121.92 29.21,121.92 29.21,114.3
N$30  (via drill 0.5 pad 2.18)
  Bottom 0.813: v69.85,42.55 69.85,45.09 67.31,47.62 D703.C IC701.1
  other vias: 67.31,52.7 67.31,50.16
N$31  (via drill 0.5 pad 2.18)
  Bottom 0.813: D702.C R703.1 | D702.C R706.2 | D702.C IC701.2
  other vias: 69.85,52.7 72.39,50.16 69.85,50.16 74.93,50.16
N$32  (via drill 0.5 pad 2.18)
  Top 0.813: R704.1 74.93,67.94 73.66,66.67 66.04,66.67 65.41,66.04 65.41,44.45 v67.31,42.55
  Bottom 0.813: 67.31,41.91 v67.31,42.55 67.31,41.27 68.58,40.01 71.12,40.01 72.39,41.27 v72.39,42.55
  other vias: 74.93,70.48
N$33  (via drill 0.5 pad 1.93, 0.5 pad 2.18, 0.5 pad 2.54)
  Bottom 0.813: v72.39,62.87 v74.93,62.87 | D701.A 68.58,70.48 R702.1 69.85,67.94 72.39,65.41 v72.39,62.87 | IC701.6 v72.39,62.87
  other vias: 72.39,60.33 67.31,69.22 69.85,70.48
N$34  (via drill 0.5 pad 2.18)
  Bottom 0.813: IC801.5 64.77,123.19 C804.1
  other vias: 63.5,124.46
N$35  (via drill 0.5 pad 2.18)
  Bottom 0.813: 52.07,129.54 R801.1 | IC801.7 60.33,122.56 60.33,125.09 59.05,126.36 53.34,126.36 52.07,127.64 52.07,129.54 | 52.07,129.54 R801.2 | 52.07,129.54 52.07,131.44 52.7,132.08 D802.A 53.68,133.69 55.88,135.89 69.22,135.89 70.78,134.32 D801.C
  other vias: 50.8,129.54 53.34,129.54
N$36  (via drill 0.5 pad 2.18)
  Bottom 0.813: R804.1 60.33,131.44 59.69,132.08 D802.C
  other vias: 60.33,129.54
N$37  (via drill 0.5 pad 2.18)
  Bottom 0.813: R804.3 65.41,131.1 D801.A
  other vias: 65.41,129.54
N$38  (via drill 0.5 pad 2.18)
  other vias: 85.09,121.92
N$39  (via drill 0.5 pad 2.18)
  other vias: 34.92,97.16
N$40  (via drill 0.5 pad 2.18)
  Top 0.813: IC801.2 59.69,116.84 62.23,119.38 IC801.6
  Bottom 0.813: C803.1 59.69,113.03 IC801.2 | IC801.6 61.59,122.56 61.59,125.09 62.87,126.36 R804.2
  other vias: 58.42,111.76 62.87,129.54
N$41  (via drill 0.5 pad 2.18)
  Bottom 0.813: R801.3 55.88,133.99 56.52,134.62 67.94,134.62 68.58,133.99 R802.1
  other vias: 55.88,129.54 68.58,129.54
N$42  (via drill 0.5 pad 3.81)
  other vias: 34.19,7.62
N$43  (via drill 0.5 pad 2.18)
  other vias: 87.63,121.92
N$44  (via drill 0.5 pad 2.18)
  other vias: 34.92,94.61
N$45  (via drill 0.5 pad 3.81)
  other vias: 6.22,106.68
N$46  (via drill 0.5 pad 2.18, 0.5 pad 2.54)
  Top 0.813: v83.82,81.92 83.82,78.74 79.38,74.3 67.31,74.3 63.5,78.11 26.04,78.11 20.95,73.03 20.95,67.31 19.05,65.41 v19.05,62.87
  Bottom 0.813: IC301.5 v19.05,62.87
  other vias: 19.05,60.33
N$47  (via drill 0.5 pad 2.18)
  Bottom 0.813: R307.2 OK301.1
  other vias: 26.67,30.48 26.67,28.57
N$48  (via drill 0.5 pad 2.18)
  Bottom 0.813: IC804.2 71.12,109.86 71.75,109.22 R812.2 80.64,109.22 82.55,111.12 | R807.3 89.53,127 89.53,111.12 88.27,109.86 85.72,109.86 84.45,111.12 82.55,111.12 | R807.3 R807.2 | 82.55,111.12 IC803.2 | R807.3 87,134.62 87,135.25 86.36,135.89 81.92,135.89 81.28,135.25 TP802.TP
  other vias: 71.12,114.3 76.2,109.22 82.55,114.3 84.45,129.54 87,129.54 81.28,133.99
N$49  (via drill 0.5 pad 2.18)
  Bottom 0.813: OK301.2 OK302.1
  other vias: 31.75,30.48 29.21,30.48
N$50  (via drill 0.5 pad 2.18)
  other vias: 76.2,121.92
N$51  (via drill 0.5 pad 2.18)
  Bottom 0.813: IC601.2 R604.2 54.61,47.62 57.15,45.09 v57.15,42.55
  other vias: 54.61,52.7 54.61,50.16
N$52  (via drill 0.5 pad 2.18)
  Bottom 0.813: v81.92,129.54 84.45,132.08 v84.45,133.99
N$53  (via drill 0.5 pad 2.18, 0.6)
  Top 0.813: D601.A 52.07,48.9 53.34,47.62 55.88,47.62 57.15,48.9 R601.2
  Bottom 0.813: D601.A IC601.1 | 60.96,42.55 v62.23,42.55 | v59.69,42.55 60.96,42.55 | 60.96,42.55 60.96,45.09 57.15,48.9 R601.2
  other vias: 52.07,52.7 52.07,50.16 57.15,50.16 52.07,50.16 57.15,50.16
N$54  (via drill 0.5 pad 2.18)
  Top 0.813: R602.2 59.69,48.9 60.96,47.62 62.87,47.62 64.14,48.9 64.14,64.77 62.87,66.04 60.96,66.04 59.69,64.77 v59.69,62.87
  Bottom 0.813: v59.69,62.87 IC601.6
  other vias: 57.15,60.33 59.69,50.16
N$55  (via drill 0.5 pad 2.18)
  Bottom 0.813: IC601.7 v57.15,62.87 59.69,65.41 R603.2 D602.C
  other vias: 54.61,60.33 59.69,74.3 59.69,70.48
N$56  (via drill 0.5 pad 3.81)
  other vias: 6.22,81.28
N$57  (via drill 0.5 pad 2.18)
  Top 1.27: R607.2 IC601.5
  other vias: 59.69,60.33
N$58  (via drill 0.5 pad 2.18)
  Bottom 0.813: R503.2 53.34,34.29 52.7,33.66 43.81,33.66 43.18,33.02 R504.1
  other vias: 43.18,30.48 54.61,34.29
N$59  (via drill 0.5 pad 2.18)
  other vias: 29.84,144.15
N$60  (via drill 0.5 pad 2.18)
  other vias: 73.66,121.92
N$61  (via drill 0.5 pad 2.18)
  Top 1.27: IC601.3 R605.2
  other vias: 57.15,52.7
N$62  (via drill 0.5 pad 2.18)
  other vias: 83.82,60.33
N$63  (via drill 0.5 pad 2.18)
  other vias: 86.36,60.33
N$64  (via drill 0.5 pad 2.18)
  other vias: 34.92,92.08
N$65  (via drill 0.5 pad 2.18)
  other vias: 50.16,141.6
N$66  (via drill 0.5 pad 2.18)
  other vias: 52.7,141.6
N$67  (via drill 0.5 pad 2.18)
  other vias: 55.24,141.6
N$68  (via drill 0.5 pad 2.18)
  other vias: 57.78,141.6
N$69  (via drill 0.5 pad 2.18)
  other vias: 60.33,141.6
N$70  (via drill 0.5 pad 2.18)
  other vias: 62.87,141.6
N$71  (via drill 0.5 pad 2.18)
  other vias: 65.41,141.6
N$72  (via drill 0.5 pad 2.18)
  other vias: 67.94,141.6
N$73  (via drill 0.5 pad 2.18)
  other vias: 70.48,141.6
N$74  (via drill 0.5 pad 2.18)
  other vias: 73.03,141.6
N$75  (via drill 0.5 pad 2.18)
  other vias: 73.03,144.15
N$76  (via drill 0.5 pad 2.18)
  other vias: 70.48,144.15
N$77  (via drill 0.5 pad 2.18)
  other vias: 67.94,144.15
N$78  (via drill 0.5 pad 2.18)
  other vias: 65.41,144.15
N$79  (via drill 0.5 pad 2.18)
  other vias: 62.87,144.15
N$80  (via drill 0.5 pad 2.18)
  other vias: 60.33,144.15
N$81  (via drill 0.5 pad 2.18)
  other vias: 57.78,144.15
N$82  (via drill 0.5 pad 2.18)
  other vias: 55.24,144.15
N$83  (via drill 0.5 pad 2.18)
  other vias: 52.7,144.15
N$84  (via drill 0.5 pad 2.18)
  other vias: 50.16,144.15
N$85  (via drill 0.5 pad 2.18)
  other vias: 34.92,89.53
N$86  (via drill 0.5 pad 2.18)
  other vias: 47.62,141.6
N$87  (via drill 0.5 pad 2.18)
  Bottom 0.813: v3.17,26.04 5.08,27.94 6.35,27.94 12.7,21.59 12.7,17.14 12.7,15.88 10.16,13.34 R1002.2
  other vias: 8.89,13.34
N$88  (via drill 0.5 pad 2.18, 0.5 pad 2.54)
  Bottom 0.813: K1001.1 D1002.C D1001.A R1002.1
  other vias: 16.51,18.41 16.51,13.34 16.51,15.88 16.51,20.95
N$89  (via drill 0.5 pad 2.54)
  other vias: 8.89,38.73
N$90  (via drill 0.5 pad 2.54)
  other vias: 16.51,38.73
N$91  (via drill 0.5 pad 2.18)
  other vias: 19.05,121.92
N$92  (via drill 0.5 pad 2.18)
  other vias: 21.59,121.92
N$93  (via drill 0.5 pad 2.18)
  other vias: 24.13,121.92
N$94  (via drill 0.5 pad 2.18)
  other vias: 34.92,87
N$95  (via drill 0.5 pad 2.18)
  other vias: 40.01,141.6
N$96  (via drill 0.5 pad 2.18)
  other vias: 34.92,84.45
N$97  (via drill 0.5 pad 2.18)
  Bottom 0.813: IC802.2 R805.1 81.28,47.62 83.82,45.09 v83.82,42.55
  other vias: 81.28,52.7 81.28,50.16
N$98  (via drill 0.5 pad 2.18)
  other vias: 37.47,99.69
N$99  (via drill 0.5 pad 2.18)
  other vias: 37.47,97.16
N$100  (via drill 0.5 pad 2.18)
  other vias: 37.47,94.61
N$101  (via drill 0.5 pad 2.18)
  other vias: 37.47,92.08
N$102  (via drill 0.5 pad 2.18)
  other vias: 37.47,89.53
N$103  (via drill 0.5 pad 2.18)
  other vias: 37.47,87
N$104  (via drill 0.5 pad 2.18)
  other vias: 37.47,84.45
N$105  (via drill 0.5 pad 2.18)
  Bottom 0.813: R606.1 D603.C
  other vias: 62.23,50.16 62.23,52.7
N$106  (via drill 0.5 pad 2.18)
  Top 1.27: IC501.3 R516.2
  other vias: 43.18,52.7
N$107  (via drill 0.5 pad 2.18)
  other vias: 40.01,84.45
N$108  (via drill 0.5 pad 2.18)
  other vias: 40.01,87
N$109  (via drill 0.5 pad 2.18)
  other vias: 40.01,89.53
N$110  (via drill 0.5 pad 2.18)
  other vias: 40.01,92.08
N$111  (via drill 0.5 pad 2.18)
  other vias: 40.01,94.61
N$112  (via drill 0.5 pad 2.18)
  other vias: 40.01,97.16
N$113  (via drill 0.5 pad 2.18)
  other vias: 40.01,99.69
N$114  (via drill 0.5 pad 2.18)
  other vias: 42.55,99.69
N$115  (via drill 0.5 pad 2.18)
  other vias: 42.55,97.16
N$116  (via drill 0.5 pad 2.18)
  other vias: 42.55,94.61
N$117  (via drill 0.5 pad 2.18)
  other vias: 42.55,92.08
N$118  (via drill 0.5 pad 2.18)
  other vias: 42.55,89.53
N$119  (via drill 0.5 pad 2.18)
  other vias: 42.55,87
N$120  (via drill 0.5 pad 2.18)
  other vias: 42.55,84.45
N$121  (via drill 0.5 pad 2.18)
  Top 0.813: R608.1 55.88,70.48 | R609.1 55.88,70.48 | 55.88,70.48 55.88,69.22 56.52,68.58 60.96,68.58 62.23,69.85 D604.A
  Bottom 0.813: R609.1 R608.1
  other vias: 62.23,70.48 57.15,70.48 54.61,70.48
N$122  (via drill 0.5 pad 2.18)
  other vias: 45.09,99.69
N$123  (via drill 0.5 pad 2.18)
  other vias: 47.62,99.69
N$124  (via drill 0.5 pad 2.18)
  other vias: 50.16,99.69
N$125  (via drill 0.5 pad 2.18)
  other vias: 52.7,99.69
N$126  (via drill 0.5 pad 2.18)
  other vias: 55.24,99.69
N$127  (via drill 0.5 pad 2.18)
  other vias: 57.78,102.23
N$128  (via drill 0.5 pad 2.18)
  other vias: 60.33,99.69
N$129  (via drill 0.5 pad 2.18)
  other vias: 60.33,102.23
N$130  (via drill 0.5 pad 2.18)
  other vias: 45.09,97.16
N$131  (via drill 0.5 pad 2.18)
  other vias: 47.62,97.16
N$132  (via drill 0.5 pad 2.18)
  other vias: 50.16,97.16
N$133  (via drill 0.5 pad 2.18)
  other vias: 52.7,97.16
N$134  (via drill 0.5 pad 2.18)
  other vias: 55.24,97.16
N$135  (via drill 0.5 pad 2.18)
  other vias: 57.78,99.69
N$136  (via drill 0.5 pad 2.18)
  other vias: 57.78,97.16
N$137  (via drill 0.5 pad 2.18)
  other vias: 60.33,97.16
N$138  (via drill 0.5 pad 2.18)
  other vias: 40.01,102.23
N$139  (via drill 0.5 pad 2.18)
  other vias: 42.55,102.23
N$140  (via drill 0.5 pad 2.18)
  other vias: 45.09,102.23
N$141  (via drill 0.5 pad 2.18)
  other vias: 47.62,102.23
N$142  (via drill 0.5 pad 2.18)
  other vias: 50.16,102.23
N$143  (via drill 0.5 pad 2.18)
  other vias: 52.7,102.23
N$144  (via drill 0.5 pad 2.18)
  other vias: 55.24,102.23
N$145  (via drill 0.5 pad 2.18)
  other vias: 45.09,94.61
N$146  (via drill 0.5 pad 2.18)
  other vias: 45.09,92.08
N$147  (via drill 0.5 pad 2.18)
  other vias: 45.09,89.53
N$148  (via drill 0.5 pad 2.18)
  other vias: 45.09,87
N$149  (via drill 0.5 pad 2.18)
  other vias: 45.09,84.45
N$150  (via drill 0.5 pad 2.18)
  Top 1.27: R517.2 IC501.5
  other vias: 45.72,60.33
N$151  (via drill 0.5 pad 2.18)
  Top 1.27: R408.2 IC401.5
  other vias: 31.75,60.33
N$152  (via drill 0.5 pad 2.18)
  other vias: 47.62,84.45
N$153  (via drill 0.5 pad 2.18)
  other vias: 47.62,87
N$154  (via drill 0.5 pad 2.18)
  other vias: 47.62,89.53
N$155  (via drill 0.5 pad 2.18)
  other vias: 47.62,92.08
N$156  (via drill 0.5 pad 2.18)
  other vias: 47.62,94.61
N$157  (via drill 0.5 pad 2.18)
  other vias: 50.16,94.61
N$158  (via drill 0.5 pad 2.18)
  other vias: 52.7,94.61
N$159  (via drill 0.5 pad 2.18)
  other vias: 55.24,94.61
N$160  (via drill 0.5 pad 2.18)
  other vias: 57.78,94.61
N$161  (via drill 0.5 pad 2.18)
  other vias: 60.33,94.61
N$162  (via drill 0.5 pad 2.18)
  other vias: 50.16,92.08
N$163  (via drill 0.5 pad 2.18)
  other vias: 52.7,92.08
N$164  (via drill 0.5 pad 2.18)
  other vias: 55.24,92.08
N$165  (via drill 0.5 pad 2.18)
  other vias: 57.78,92.08
N$166  (via drill 0.5 pad 2.18)
  other vias: 60.33,92.08
N$167  (via drill 0.5 pad 2.18)
  other vias: 50.16,89.53
N$168  (via drill 0.5 pad 2.18)
  other vias: 52.7,89.53
N$169  (via drill 0.5 pad 2.18)
  other vias: 55.24,89.53
N$170  (via drill 0.5 pad 2.18)
  other vias: 57.78,89.53
N$171  (via drill 0.5 pad 2.18)
  other vias: 60.33,89.53
N$172  (via drill 0.5 pad 2.18)
  other vias: 50.16,87
N$173  (via drill 0.5 pad 2.18)
  other vias: 52.7,87
N$174  (via drill 0.5 pad 2.18)
  other vias: 55.24,87
N$175  (via drill 0.5 pad 2.18)
  other vias: 57.78,87
N$176  (via drill 0.5 pad 2.18)
  other vias: 60.33,87
N$177  (via drill 0.5 pad 2.18)
  other vias: 60.33,84.45
N$178  (via drill 0.5 pad 2.18)
  Top 1.27: IC701.3 R707.2
  other vias: 72.39,52.7
N$179  (via drill 0.5 pad 2.18)
  Top 1.27: R708.2 IC701.5
  other vias: 74.93,60.33
N$180  (via drill 0.5 pad 2.18)
  other vias: 57.78,84.45
N$181  (via drill 0.5 pad 2.18)
  other vias: 55.24,84.45
N$185  (via drill 0.5 pad 2.18)
  other vias: 50.16,84.45
N$186  (via drill 0.5 pad 2.18)
  other vias: 52.7,84.45
N$187  (via drill 0.5 pad 2.18)
  other vias: 37.47,102.23
N$188  (via drill 0.5 pad 2.18)
  other vias: 34.92,102.23
N$189  (via drill 0.5 pad 2.18)
  other vias: 40.01,104.78
N$190  (via drill 0.5 pad 2.18)
  other vias: 42.55,104.78
N$191  (via drill 0.5 pad 2.18)
  other vias: 45.09,104.78
N$192  (via drill 0.5 pad 2.18)
  other vias: 47.62,104.78
N$193  (via drill 0.5 pad 2.18)
  other vias: 50.16,104.78
N$194  (via drill 0.5 pad 2.18)
  other vias: 52.7,104.78
N$195  (via drill 0.5 pad 2.18)
  other vias: 55.24,104.78
N$196  (via drill 0.5 pad 2.18)
  other vias: 57.78,104.78
N$197  (via drill 0.5 pad 2.18)
  other vias: 60.33,104.78
N$198  (via drill 0.5 pad 2.18)
  other vias: 62.87,87
N$199  (via drill 0.5 pad 2.18)
  other vias: 62.87,89.53
N$200  (via drill 0.5 pad 2.18)
  other vias: 62.87,92.08
N$201  (via drill 0.5 pad 2.18)
  other vias: 65.41,89.53
N$202  (via drill 0.5 pad 2.18)
  other vias: 65.41,92.08
N$203  (via drill 0.5 pad 2.18)
  other vias: 65.41,94.61
N$204  (via drill 0.5 pad 2.18)
  other vias: 62.87,94.61
N$205  (via drill 0.5 pad 2.18)
  other vias: 62.87,97.16
N$206  (via drill 0.5 pad 2.18)
  other vias: 65.41,97.16
N$207  (via drill 0.5 pad 2.18)
  other vias: 65.41,99.69
N$208  (via drill 0.5 pad 2.18)
  other vias: 62.87,99.69
N$209  (via drill 0.5 pad 2.18)
  other vias: 62.87,102.23
N$210  (via drill 0.5 pad 2.18)
  other vias: 62.87,104.78
N$211  (via drill 0.5 pad 2.18)
  other vias: 65.41,104.78
N$212  (via drill 0.5 pad 2.18)
  other vias: 65.41,102.23
N$213  (via drill 0.5 pad 2.18)
  other vias: 67.94,94.61
N$214  (via drill 0.5 pad 2.18)
  other vias: 67.94,97.16
N$215  (via drill 0.5 pad 2.18)
  other vias: 67.94,99.69
N$216  (via drill 0.5 pad 2.18)
  other vias: 70.48,99.69
N$217  (via drill 0.5 pad 2.18)
  other vias: 73.03,99.69
N$218  (via drill 0.5 pad 2.18)
  other vias: 75.56,99.69
N$219  (via drill 0.5 pad 2.18)
  other vias: 70.48,97.16
N$220  (via drill 0.5 pad 2.18)
  other vias: 73.03,97.16
N$221  (via drill 0.5 pad 2.18)
  other vias: 75.56,97.16
N$222  (via drill 0.5 pad 2.18)
  other vias: 75.56,94.61
N$223  (via drill 0.5 pad 2.18)
  other vias: 73.03,94.61
N$224  (via drill 0.5 pad 2.18)
  other vias: 70.48,94.61
N$225  (via drill 0.5 pad 2.18)
  other vias: 52.7,107.31
N$226  (via drill 0.5 pad 2.18)
  other vias: 55.24,107.31
N$227  (via drill 0.5 pad 2.18)
  other vias: 57.78,107.31
N$228  (via drill 0.5 pad 2.18)
  other vias: 60.33,107.31
N$229  (via drill 0.5 pad 2.18)
  other vias: 62.87,107.31
N$230  (via drill 0.5 pad 2.18)
  other vias: 52.7,109.86
N$231  (via drill 0.5 pad 2.18)
  other vias: 55.24,109.86
N$232  (via drill 0.5 pad 2.18)
  other vias: 45.09,107.31
N$233  (via drill 0.5 pad 2.18)
  other vias: 45.09,109.86
N$234  (via drill 0.5 pad 2.18)
  other vias: 42.55,107.31
N$235  (via drill 0.5 pad 2.18)
  other vias: 32.38,99.69
N$236  (via drill 0.5 pad 2.18)
  other vias: 32.38,102.23
N$237  (via drill 0.5 pad 2.18)
  other vias: 32.38,97.16
N$238  (via drill 0.5 pad 2.18)
  other vias: 75.56,102.23
N$239  (via drill 0.5 pad 2.18)
  other vias: 75.56,104.78
N$240  (via drill 0.5 pad 2.18)
  other vias: 75.56,92.08
PWM  (via drill 0.5 pad 1.42, 0.5 pad 2.18)
  Top 0.813: IC901.3 40.64,116.84 43.18,119.38 IC901.11 43.18,123.83 45.72,126.36 64.14,126.36 66.67,123.83 66.67,121.28 62.23,116.84 IC801.3
  Bottom 0.813: IC902.5 26.67,110.49 26.67,108.58 28.57,106.68 33.66,106.68 TP904.TP 40.64,113.67 IC901.3
  other vias: 40.64,114.3 43.18,121.92 26.67,114.3 26.67,114.3 35.56,108.58
PWM_ENABLE  (via drill 0.5 pad 2.18)  (1 unrouted)
  Top 0.406: IC902.13 19.05,128.27
  Top 0.813: R1003.2 18.41,102.87 18.41,81.28 4.45,67.31 4.45,36.83 5.71,35.56 OK1001.3 | TP908.TP 37.47,128.91 36.83,128.27 19.05,128.27 17.78,128.27 14.61,125.09 14.61,119.38 15.88,118.11 22.86,118.11 24.13,116.84 IC902.4
  Bottom 0.813: R1003.2 IC902.4
  other vias: 5.71,33.66 24.13,108.58 24.13,114.3 37.47,130.81 37.47,130.81
RAMP_DISABLE  (via drill 0.5 pad 2.18, 0.5 pad 2.54)
  Bottom 0.813: IC401.6 v29.21,62.87 v26.67,62.87 23.5,66.04 10.16,66.04 5.71,61.59 5.71,38.73 8.89,35.56 K1001.11
  other vias: 29.21,60.33 8.89,33.66
SP_CURRENT  (via drill 0.5 pad 2.18)
  Bottom 0.813: SV101.15 TP702.TP v42.55,133.35
  other vias: 42.55,141.6 42.55,135.89 42.55,135.89
SP_CURRENT_TO_RC  (via drill 0.5 pad 2.18, 0.5 pad 2.54)
  Bottom 0.813: IC701.7 v69.85,62.87 68.58,62.87 v67.31,64.14 64.77,66.67 64.77,69.85 69.22,74.3 82.55,74.3 90.81,82.55 90.81,133.99 87.63,137.16 51.44,137.16 R705.1
  other vias: 69.85,60.33 50.16,135.89 50.16,135.89
SP_SPEED  (via drill 0.5 pad 2.18, 0.5 pad 3.81)
  Bottom 0.813: 12.7,42.55 v11.43,42.55 | 12.7,42.55 v13.97,42.55 v16.51,42.55 | 12.7,42.55 12.7,27.94 17.14,23.5 43.81,23.5 54.71,12.6 X103.1
  other vias: 54.71,7.62
SPEED_ENABLE_1  (via drill 0.5 pad 2.18, 0.5 pad 2.54)
  Top 0.813: R513.2 48.26,60.33 v45.72,62.87
  Bottom 0.813: IC501.6 v43.18,62.87 v45.72,62.87 46.99,64.14 v48.26,64.14 | R513.2 48.26,48.26 50.16,46.35 50.16,41.27 51.44,40.01 62.23,40.01 67.31,34.92 67.31,28.57 64.77,26.04 24.13,26.04 K1001.6
  other vias: 43.18,60.33 48.26,50.16 16.51,33.66
SPEED_ENABLE_2  (via drill 0.5 pad 2.18, 0.5 pad 2.54)
  Bottom 0.813: R515.2 37.47,66.67 36.2,67.94 36.2,72.39 C504.2 R508.2
  other vias: 38.1,66.67 34.29,74.3
SPEED_RAMP_OUT  (via drill 0.5 pad 2.18, 0.5 pad 2.54)
  Top 0.813: v31.75,42.55 34.29,45.09 R511.1 TP503.TP 32.38,54.61 26.04,54.61 24.77,55.88 24.77,58.42 IC401.7
  Bottom 0.813: IC401.7 24.13,62.87 v22.86,62.87 20.95,64.77 10.79,64.77 6.99,60.96 6.99,41.91 8.26,40.64 10.16,40.64 11.43,39.37 11.43,31.11 K1001.13 | TP503.TP R511.1
  other vias: 26.67,60.33 34.29,50.16 8.89,28.57 34.29,52.7
SPEED_REG_OUT  (via drill 0.5 pad 1.93, 0.5 pad 2.18, 0.5 pad 2.54, 0.6)
  Top 0.813: 72.39,72.39 R701.1 | 72.39,72.39 75.56,72.39 76.83,71.12 76.83,58.42 78.11,57.15 85.72,57.15 88.9,53.98 TP504.TP 88.9,51.44 81.28,43.81 v81.28,42.55 | v52.07,42.55 52.07,40.64 52.7,40.01 73.66,40.01 74.93,41.27 v74.93,42.55 | 72.39,72.39 67.31,72.39 62.23,67.31 53.98,67.31 52.07,69.22 R514.2
  Bottom 0.813: v81.28,42.55 v74.93,42.55 74.93,41.27 68.58,34.92 68.58,27.94 65.41,24.77 20.32,24.77 K1001.4 | R515.1 39.37,69.22 40.64,67.94 46.99,67.94 C501.2 | C501.2 48.26,75.56 | R514.2 50.8,69.22 C501.2 | 48.26,75.56 JP501.2 | 48.26,75.56 50.8,75.56 D602.A
  other vias: 38.1,69.22 45.72,75.56 72.39,70.48 16.51,28.57 88.9,52.7 48.26,69.22 52.07,70.48 48.26,69.22 52.07,74.3
SPEED_SP  (via drill 0.5 pad 2.18)
  Top 0.813: IC301.1 8.89,52.7 6.99,50.8 6.99,44.45 v8.89,42.55
  Bottom 0.813: v8.89,42.55 10.79,44.45 17.14,44.45 18.41,43.18 18.41,41.27 19.05,40.64 22.23,40.64 v24.13,42.55
  other vias: 11.43,52.7
TR_EN  (via drill 0.5 pad 2.18)
  Bottom 0.813: 37.47,130.81 R902.2 SV101.11
  other vias: 37.47,135.89 37.47,141.6
TR_SET  (via drill 0.5 pad 2.18)
  Top 0.813: 29.84,130.81 R901.2
  Bottom 0.813: R901.2 v34.92,141.6
  other vias: 34.92,130.81

## Text on the board
Top: ACC | DCC | CURRENT | LIMIT | COM | ENABLE | F/!B | N.C. | +15V | AGND | -15V | SPEED | AGND | TACHO | AGND | CURRENT | LIMIT | AGND
tPlace: ACC | DCC | CURRENT | LIMIT | ENABLE | F/!B | N.C. | +15V | AGND | -15V | SPEED | AGND | TACHO | AGND | CURRENT | LIMIT | AGND
tNames: COM